# EAGLE schematic newf (EAGLE 7.7.0)

## Sheet 1 of 2

## Sheet 2 of 2
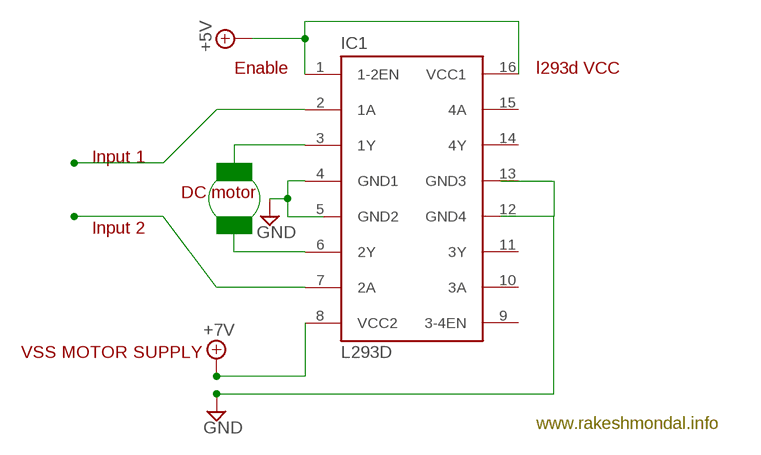
[diagram p0: schematic, sheet 2]

### Parts
IC1  L293D  [DIL16]

### Nets
+5V: IC1.1(1-2EN) IC1.16(VCC1)
+7V: IC1.8(VCC2)
GND: IC1.4(GND1)
N$4: IC1.3(1Y)
N$5: IC1.2(1A)
N$6: IC1.7(2A)
N$8: IC1.6(2Y)
Unconnected: IC1.9(3-4EN) IC1.10(3A) IC1.11(3Y) IC1.14(4Y) IC1.15(4A)

### Notes on the sheet
- Enable | l293d VCC
- Input 1
- DC motor
- Input 2
- VSS MOTOR SUPPLY
- www.rakeshmondal.info

## Power pins joined to a net without a drawn wire
GND2: IC1.5(GND2)
GND3: IC1.13(GND3)
GND4: IC1.12(GND4)

## Library data of the parts
IC1 = st-microelectronics:L293D: PUSH-PULL 4 CHANNEL DRIVER